# Altium project stimconnect.PrjPcb
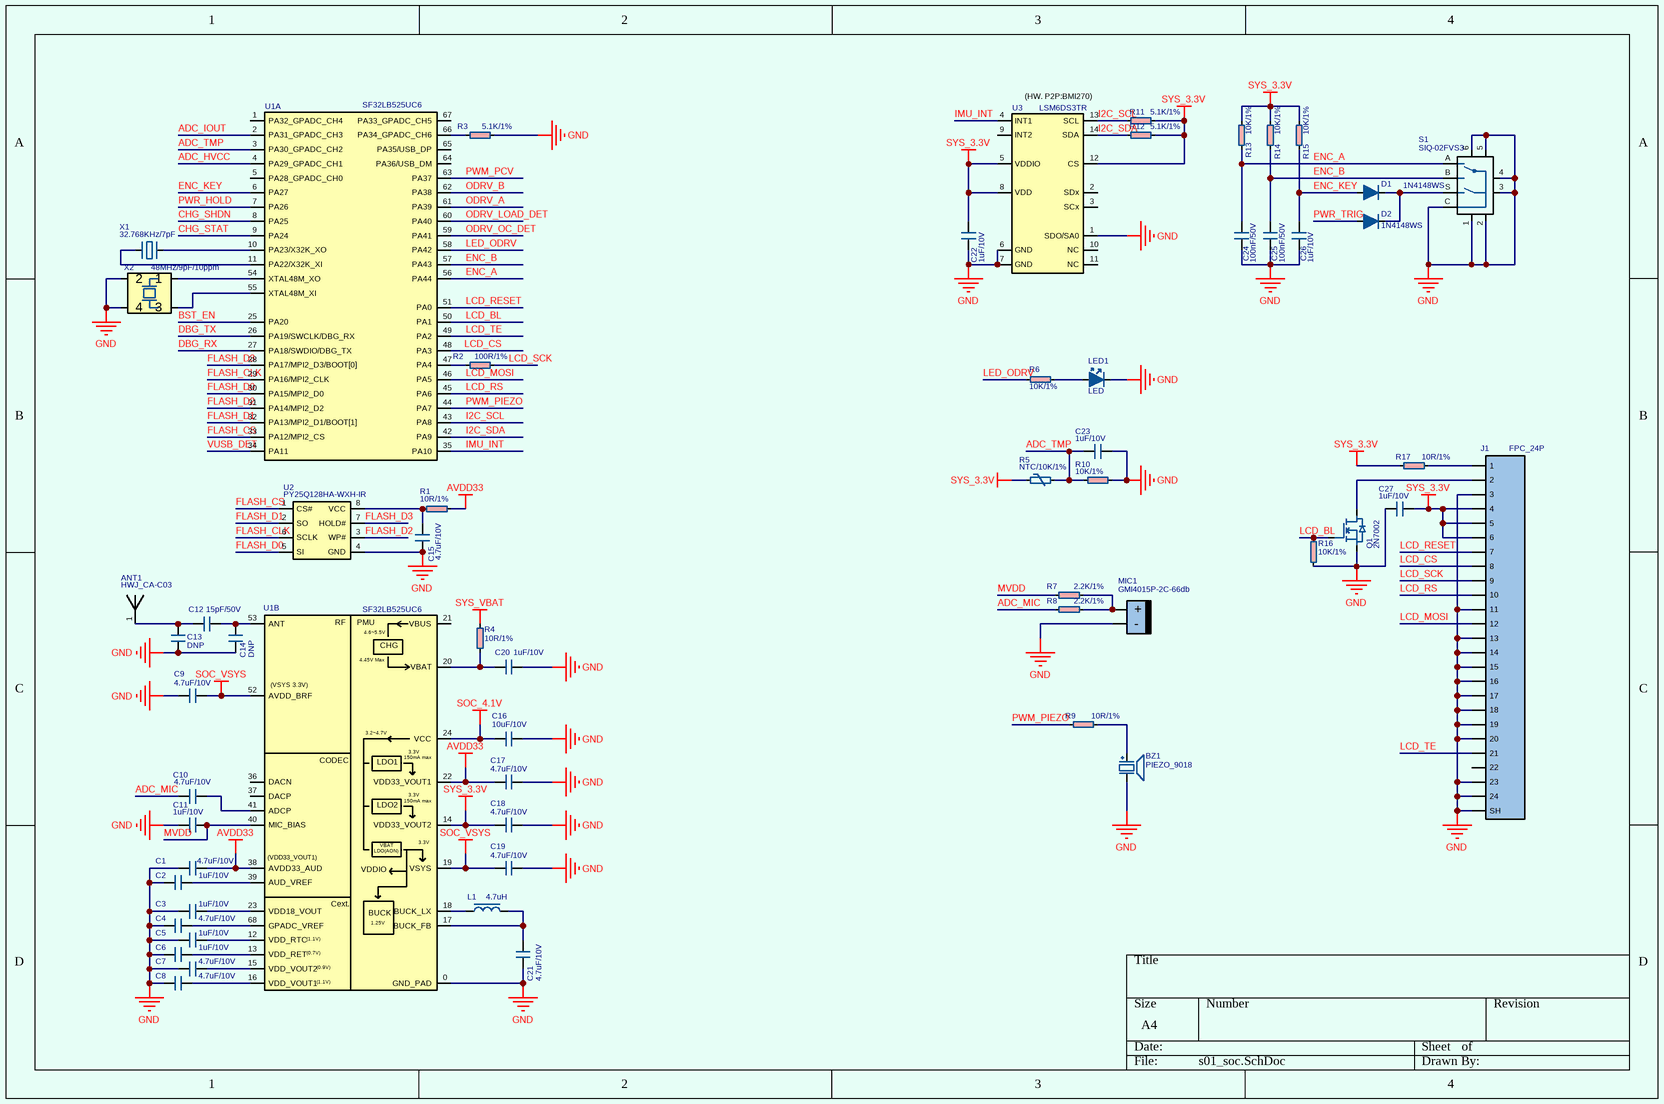
[diagram p0: s01_soc.SchDoc]
2 sheets, 184 parts. Net scope: global (net labels, ports and power ports of the same name join across sheets).
Board file: board.PcbDoc
Sheets:
  s01_soc.SchDoc
  s02_power.SchDoc

## Sheet s01_soc.SchDoc
size A4

### Parts
ANT1  HWJ_CA-C03  [ANT_2.4G_HWJ_CA-C03_MIRROR_OUTLINE]
BZ1  PIEZO_9018  [BUZZER_PIEZO_SMD_9X9X1.8MM_2PIN]
C1  4.7uF/10V  [0402C]
C2  1uF/10V  [0402C]
C3  1uF/10V  [0402C]
C4  4.7uF/10V  [0402C]
C5  1uF/10V  [0402C]
C6  1uF/10V  [0402C]
C7  4.7uF/10V  [0402C]
C8  4.7uF/10V  [0402C]
C9  4.7uF/10V  [0402C]
C10  4.7uF/10V  [0402C]
C11  1uF/10V  [0402C]
C12  15pF/50V  [0402C]
C13  DNP  [0402C]
C14  DNP  [0402C]
C15  4.7uF/10V  [0402C]
C16  10uF/10V  [0603C]
C17  4.7uF/10V  [0402C]
C18  4.7uF/10V  [0402C]
C19  4.7uF/10V  [0402C]
C20  1uF/10V  [0402C]
C21  4.7uF/10V  [0402C]
C22  1uF/10V  [0402C]
C23  1uF/10V  [0402C]
C24  100nF/50V  [0402C]
C25  100nF/50V  [0402C]
C26  1uF/10V  [0402C]
C27  1uF/10V  [0402C]
D1  1N4148WS  [SOD323]
D2  1N4148WS  [SOD323]
J1  FPC_24P  [FPC_0.5MM_24P_H1.0_DNUP_MIRROR_FH34SRJ-24S-0.5SH]
L1  4.7uH  [INDUCTOR_0806_HD]
LED1  LED  [LED_0603]
MIC1  GMI4015P-2C-66db  [MIC_DIP_F4_H1.5]
Q1  2N7002  [SOT23_MOS]
R1  10R/1%  [0402R]
R2  100R/1%  [0402R]
R3  5.1K/1%  [0402R]
R4  10R/1%  [0402R]
R5  NTC/10K/1%  [0402R]
R6  10K/1%  [0402R]
R7  2.2K/1%  [0402R]
R8  2.2K/1%  [0402R]
R9  10R/1%  [0603R]
R10  10K/1%  [0402R]
R11  5.1K/1%  [0402R]
R12  5.1K/1%  [0402R]
R13  10K/1%  [0402R]
R14  10K/1%  [0402R]
R15  10K/1%  [0402R]
R16  10K/1%  [0402R]
R17  10R/1%  [0402R]
S1  SIQ-02FVS3  [ENCODER_SMD_SIQ_02FVS3]
U1  SF32LB525UC6  [QFN68_0.35_7X7_H0.9]  (parts A,B of 2)
U2  PY25Q128HA-WXH-IR  [DFN_5X6_1.27_EPAD_FLASH]
U3  LSM6DS3TR  [LGA14_0.5_2.5X3_H0.9]
X1  32.768KHz/7pF  [XTAL_3215_2P]
X2  48MHz/9pF/10ppm  [XTAL_2016_4P_N]

### Nets
AVDD33: C1.2 C17.1 R1.1 U1.22(VDD33_VOUT1) U1.38(AVDD33_AUD)
GND: BZ1.2 C1.1 C2.1 C3.1 C4.1 C5.1 C6.1 C7.1 C8.1 C9.1 C11.1 C13.2 C14.1 C15.1 C16.1 C17.2 C18.2 C19.2 C20.1 C21.1 C22.1 C23.1 C24.1 C25.1 C26.1 C27.1 J1.0(SH) J1.3 J1.11 J1.13 J1.14 J1.15 J1.16 J1.17 J1.18 J1.19 J1.20 J1.23 J1.24 LED1.2 MIC1.2(-) Q1.S R3.2 R10.1 R16.2 S1.1 S1.2 S1.3 S1.4 S1.5 S1.6 S1.C U1.0(GND_PAD) U2.4(GND) U3.1(SDO/SA0) U3.6(GND) U3.7(GND) X2.2 X2.4
SOC_4.1V: C16.2 U1.24(VCC)
SOC_VSYS: C9.2 C19.1 U1.19(VSYS) U1.52(AVDD_BRF)
SYS_3.3V: C18.1 C22.2 C27.2 J1.4 J1.5 J1.6 R5.1 R11.1 R12.1 R13.2 R14.2 R15.2 R17.1 U1.14(VDD33_VOUT2) U3.5(VDDIO) U3.8(VDD) U3.12(CS)
SYS_VBAT: R4.1
ADC_HVCC: U1.4(PA29_GPADC_CH1)
ADC_IOUT: U1.2(PA31_GPADC_CH3)
ADC_MIC: C10.1 R8.2
ADC_TMP: C23.2 R5.2 R10.2 U1.3(PA30_GPADC_CH2)
BST_EN: U1.25(PA20)
CHG_SHDN: U1.8(PA25)
CHG_STAT: U1.9(PA24)
DBG_RX: U1.27(PA18/SWDIO/DBG_TX)
DBG_TX: U1.26(PA19/SWCLK/DBG_RX)
ENC_A: C24.2 R13.1 S1.A U1.56(PA44)
ENC_B: C25.2 R14.1 S1.B U1.57(PA43)
ENC_KEY: C26.2 D1.1 R15.1 U1.6(PA27)
FLASH_CLK: U1.29(PA16/MPI2_CLK) U2.6(SCLK)
FLASH_CS: U1.33(PA12/MPI2_CS) U2.1(CS#)
FLASH_D0: U1.30(PA15/MPI2_D0) U2.5(SI)
FLASH_D1: U1.32(PA13/MPI2_D1/BOOT[1]) U2.2(SO)
FLASH_D2: U1.31(PA14/MPI2_D2) U2.3(WP#)
FLASH_D3: U1.28(PA17/MPI2_D3/BOOT[0]) U2.7(HOLD#)
I2C_SCL: R11.2 U1.43(PA8) U3.13(SCL)
I2C_SDA: R12.2 U1.42(PA9) U3.14(SDA)
IMU_INT: U1.35(PA10) U3.4(INT1)
LCD_BL: Q1.G R16.1 U1.50(PA1)
LCD_CS: J1.8 U1.48(PA3)
LCD_MOSI: J1.12 U1.46(PA5)
LCD_RESET: J1.7 U1.51(PA0)
LCD_RS: J1.10 U1.45(PA6)
LCD_SCK: J1.9 R2.2
LCD_TE: J1.21 U1.49(PA2)
LED_ODRV: R6.2 U1.58(PA42)
MVDD: C11.2 R7.2 U1.40(MIC_BIAS)
ODRV_A: U1.61(PA39)
ODRV_B: U1.62(PA38)
ODRV_LOAD_DET: U1.60(PA40)
ODRV_OC_DET: U1.59(PA41)
PWM_PCV: U1.63(PA37)
PWM_PIEZO: R9.1 U1.44(PA7)
PWR_HOLD: U1.7(PA26)
PWR_TRIG: D2.1
VUSB_DET: U1.34(PA11)
NetANT1_1: ANT1.1(ANT) C12.2 C13.1
NetBZ1_1: BZ1.1 R9.2
NetC2_2: C2.2 U1.39(AUD_VREF)
NetC3_2: C3.2 U1.23(VDD18_VOUT)
NetC4_2: C4.2 U1.68(GPADC_VREF)
NetC5_2: C5.2 U1.12(VDD_RTC)
NetC6_2: C6.2 U1.13(VDD_RET)
NetC7_2: C7.2 U1.15(VDD_VOUT2)
NetC8_2: C8.2 U1.16(VDD_VOUT1)
NetC10_2: C10.2 U1.41(ADCP)
NetC12_1: C12.1 C14.2 U1.53(ANT)
NetC15_2: C15.2 R1.2 U2.8(VCC)
NetC20_2: C20.2 R4.2 U1.20(VBAT)
NetC21_2: C21.2 L1.2 U1.17(BUCK_FB)
NetD1_2: D1.2 D2.2 S1.S
NetJ1_1: J1.1 R17.2
NetJ1_2: J1.2 Q1.D
NetL1_1: L1.1 U1.18(BUCK_LX)
NetLED1_1: LED1.1 R6.1
NetMIC1_1: MIC1.1(+) R7.1 R8.1
NetR2_1: R2.1 U1.47(PA4)
NetR3_1: R3.1 U1.66(PA34_GPADC_CH6)
NetU1_10: U1.10(PA23/X32K_XO) X1.2
NetU1_11: U1.11(PA22/X32K_XI) X1.1
NetU1_54: U1.54(XTAL48M_XO) X2.1
NetU1_55: U1.55(XTAL48M_XI) X2.3

Not connected (* = marked no-connect by the designer): J1 22; U1 1(PA32_GPADC_CH4) 5(PA28_GPADC_CH0) 21(VBUS) 36(DACN) 37(DACP) 64(PA36/USB_DM) 65(PA35/USB_DP) 67(PA33_GPADC_CH5); U3 2(SDx) 3(SCx) 9(INT2) 10(NC) 11(NC)

### Notes on the sheet
- (near U3) (HW. P2P:BMI270)
- (in symbol SOC_SIFLI_SF32LB525UC6, part B) RF; PMU; 4.6~5.5V; CHG; 4.45V Max; (VSYS 3.3V); 3.2~4.7V; 3.3V; 150mA max; CODEC; LDO1; LDO2; LDO(AON); (VDD33_VOUT1); VDDIO; Cext.; BUCK; 1.25V; (1.1V); (0.7V); (0.9V)

### Library data of the parts
ANT1 = ANT_2.4G_HWJ_CA-C03: T-net: 0R-3nH-0R
BZ1 = BUZZER_PIEZO_2PIN
C1-C27 = CAP
D1 D2 = VD
J1 = CON24_FPC
L1 = INDUCTOR
LED1 = LED_GENERAL
MIC1 = MIC_ELE
Q1 = MOS_N
R1-R4 R6-R17 = RES
R5 = NTC
S1 = ENCODER_SIQ-02FVS3: Rotary encoder in 15 detents with push function
U1 = SOC_SIFLI_SF32LB525UC6: Li-ion power, 8MB psram, VSYS connect to VBAT
U2 = GD25Q32
U3 = LSM6DS3: always-on 3D accelerometer and 3D gyroscope
X1 = XTAL: Q13FC13500002
X2 = XTAL_SMT_PASSIVE4PIN: SX20Y048000B91T004

## Sheet s02_power.SchDoc
size A4
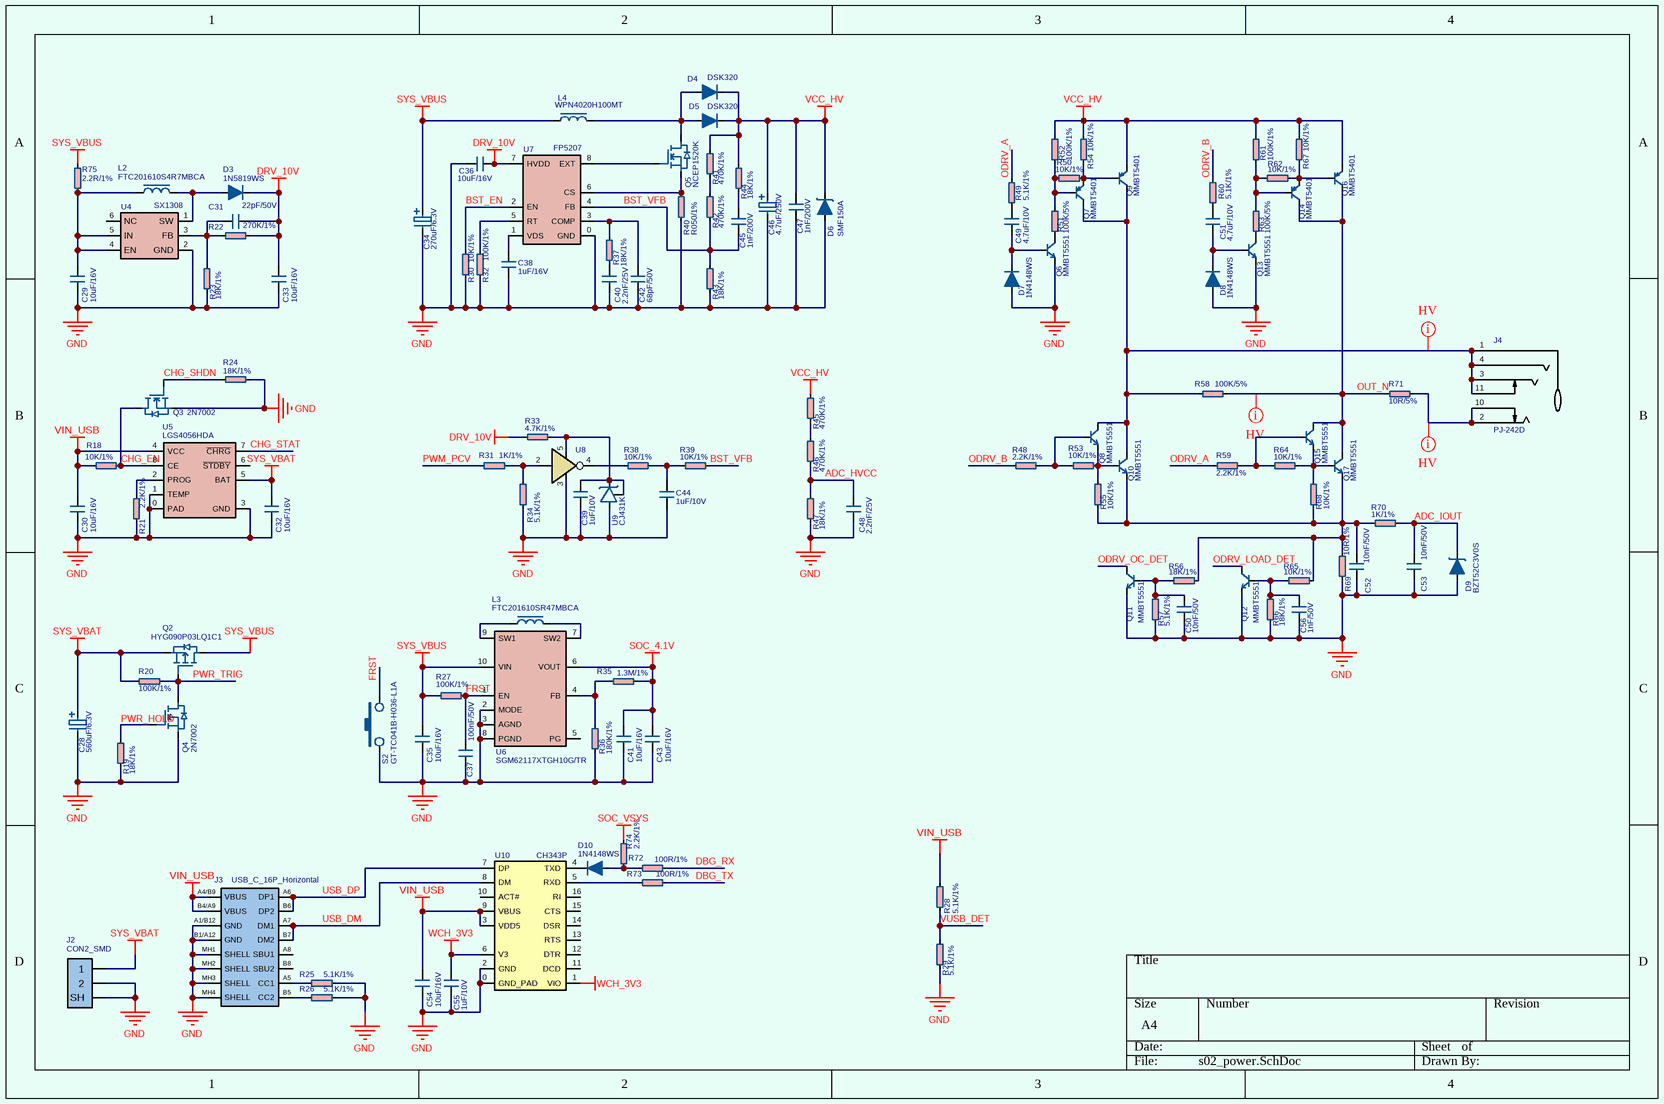
[diagram p1: s02_power.SchDoc]

### Parts
C28  560uF/6.3V  [CAP_EL_DIP_6.3X11_HOR_REV]
C29  10uF/16V  [0603C]
C30  10uF/16V  [0603C]
C31  22pF/50V  [0402C]
C32  10uF/16V  [0603C]
C33  10uF/16V  [0603C]
C34  270uF/6.3V  [CAP_EL_DIP_6.3X11_HOR_REV]
C35  10uF/16V  [0603C]
C36  10uF/16V  [0603C]
C37  100nF/50V  [0402C]
C38  1uF/16V  [0402C]
C39  1uF/10V  [0402C]
C40  2.2nF/25V  [0402C]
C41  10uF/16V  [0603C]
C42  68pF/50V  [0402C]
C43  10uF/16V  [0603C]
C44  1uF/10V  [0402C]
C45  1nF/200V  [0805C_N_HD]
C46  4.7uF/250V  [CAP_EL_DIP_6.3X11_HOR_REV]
C47  1nF/200V  [0805C_N_HD]
C48  2.2nF/25V  [0402C]
C49  4.7uF/10V  [0402C]
C50  10nF/50V  [0402C]
C51  4.7uF/10V  [0402C]
C52  10nF/50V  [0402C]
C53  10nF/50V  [0402C]
C54  10uF/16V  [0603C]
C55  1uF/10V  [0402C]
C56  1nF/50V  [0402C]
D3  1N5819WS  [SOD323_N]
D4  DSK320  [SOD123_N_HD]
D5  DSK320  [SOD123_N_HD]
D6  SMF150A  [SOD123_N_HD]
D7  1N4148WS  [SOD323]
D8  1N4148WS  [SOD323]
D9  BZT52C3V0S  [SOD323_N]
D10  1N4148WS  [SOD323]
J2  CON2_SMD  [PRT_1.25MM_2PIN_HOR_SMD]
J3  USB_C_16P_Horizontal  [USB_C_16P_FEMALE_HOR_L7.3_HD]
J4  PJ-242D  [CON_AUDIO_PJ_242]
L2  FTC201610S4R7MBCA  [INDUCTOR_0806_HD]
L3  FTC201610SR47MBCA  [INDUCTOR_0806_HD]
L4  WPN4020H100MT  [INDUCTOR_SWPA4020S]
Q2  HYG090P03LQ1C1  [DFN8_MOS_3X3]
Q3  2N7002  [SOT23_MOS]
Q4  2N7002  [SOT23_MOS]
Q5  NCEP1520K  [TO252_MOS]
Q6  MMBT5551  [SOT23_BCE]
Q7  MMBT5401  [SOT23_BCE]
Q8  MMBT5551  [SOT23_BCE]
Q9  MMBT5401  [SOT23_BCE]
Q10  MMBT5551  [SOT23_BCE]
Q11  MMBT5551  [SOT23_BCE]
Q12  MMBT5551  [SOT23_BCE]
Q13  MMBT5551  [SOT23_BCE]
Q14  MMBT5401  [SOT23_BCE]
Q15  MMBT5551  [SOT23_BCE]
Q16  MMBT5401  [SOT23_BCE]
Q17  MMBT5551  [SOT23_BCE]
R18  10K/1%  [0402R]
R19  18K/1%  [0402R]
R20  100K/1%  [0402R]
R21  2.2K/1%  [0402R]
R22  270K/1%  [0402R]
R23  18K/1%  [0402R]
R24  18K/1%  [0402R]
R25  5.1K/1%  [0402R]
R26  5.1K/1%  [0402R]
R27  100K/1%  [0402R]
R28  5.1K/1%  [0402R]
R29  5.1K/1%  [0402R]
R30  10K/1%  [0402R]
R31  1K/1%  [0402R]
R32  100K/1%  [0402R]
R33  4.7K/1%  [0402R]
R34  5.1K/1%  [0402R]
R35  1.3M/1%  [0402R]
R36  180K/1%  [0402R]
R37  18K/1%  [0402R]
R38  10K/1%  [0402R]
R39  10K/1%  [0402R]
R40  R050/1%  [1206R_N_HD]
R41  470K/1%  [0805R_N_HD]
R42  470K/1%  [0805R_N_HD]
R43  18K/1%  [0402R]
R44  18K/1%  [0402R]
R45  470K/1%  [0805R_N_HD]
R46  470K/1%  [0805R_N_HD]
R47  18K/1%  [0402R]
R48  2.2K/1%  [0402R]
R49  5.1K/1%  [0402R]
R50  10K/1%  [0402R]
R51  100K/5%  [0805R]
R52  100K/1%  [0402R]
R53  10K/1%  [0402R]
R54  10K/1%  [0402R]
R55  10K/1%  [0402R]
R56  18K/1%  [0402R]
R57  5.1K/1%  [0402R]
R58  100K/5%  [0805R]
R59  2.2K/1%  [0402R]
R60  5.1K/1%  [0402R]
R61  100K/1%  [0402R]
R62  10K/1%  [0402R]
R63  100K/5%  [0805R]
R64  10K/1%  [0402R]
R65  10K/1%  [0402R]
R66  18K/1%  [0402R]
R67  10K/1%  [0402R]
R68  10K/1%  [0402R]
R69  10R/1%  [0805R_N_HD]
R70  1K/1%  [0402R]
R71  10R/5%  [0805R]
R72  100R/1%  [0402R]
R73  100R/1%  [0402R]
R74  2.2K/1%  [0402R]
R75  2.2R/1%  [0402R]
S2  GT-TC041B-H036-L1A  [SW_MEDIUM_TURTLE]
U4  SX1308  [SOT23_6]
U5  LGS4056HDA  [DFN8_0.5_2X2]
U6  SGM62117XTGH10G/TR  [DFN8_0.5_3X2_SGM62117]
U7  FP5207  [SOP8_150MIL_PAD_N_HD]
U8  SN74LVC1G14DBVR  [SOT23_5]  (value not drawn)
U9  CJ431K  [SOT23]
U10  CH343P  [QFN16_0.5_3X3]

### Nets
DRV_10V: C31.1 C33.1 C36.1 D3.2 R22.1 R33.1 U7.7(HVDD)
GND: C28.2 C29.2 C30.2 C32.2 C33.2 C34.2 C35.2 C36.2 C37.1 C38.1 C39.1 C40.1 C41.2 C42.1 C43.2 C44.1 C46.2 C47.1 C48.1 C50.1 C52.1 C53.1 C54.2 C55.1 C56.1 D6.1 D7.1 D8.1 D9.1 J2.0(SH) J2.2 J3.A1/B12(GND) J3.B1/A12(GND) J3.MH1(SHELL) J3.MH2(SHELL) J3.MH3(SHELL) J3.MH4(SHELL) Q3.S Q4.S Q6.E Q11.E Q12.E Q13.E R19.1 R21.2 R23.1 R24.1 R25.1 R26.1 R29.1 R30.1 R32.1 R34.2 R36.2 R40.1 R43.1 R47.1 R57.2 R66.2 R69.2 S2.2 U4.2(GND) U5.0(PAD) U5.1(TEMP) U5.3(GND) U6.2(MODE) U6.3(AGND) U6.8(PGND) U7.0(GND) U8.3(G) U9.3 U10.0(GND_PAD) U10.2(GND)
SOC_4.1V: C41.1 C43.1 R35.2 U6.6(VOUT)
SOC_VSYS: R74.1
SYS_VBAT: C28.1 C32.1 J2.1 Q2.S R20.2 U5.5(BAT)
SYS_VBUS: C34.1 C35.1 L4.1 Q2.D R27.2 R75.1 U6.10(VIN)
VCC_HV: C46.1 C47.2 D4.2 D5.2 D6.2 Q9.E Q16.E R41.2 R44.2 R45.2 R52.1 R54.1 R61.1 R67.1
VIN_USB: C30.1 C54.1 J3.A4/B9(VBUS) J3.B4/A9(VBUS) R18.2 R28.2 U5.4(VCC) U10.3(VDD5) U10.9(VBUS)
WCH_3V3: C55.2 U10.1(VIO) U10.6(V3)
ADC_HVCC: C48.2 R46.1 R47.2
ADC_IOUT: C53.2 D9.2 R70.1
BST_EN: R30.2 U7.2(EN)
BST_VFB: C45.1 R39.1 R42.1 R43.2 U7.4(FB)
CHG_EN: Q3.D R18.1 U5.8(CE)
CHG_SHDN: Q3.G R24.2
CHG_STAT: U5.7(~{CHRG})
DBG_RX: R72.1
DBG_TX: R73.1
FRST: C37.2 R27.1 S2.1 U6.1(EN)
ODRV_A: R49.2 R59.2
ODRV_B: R48.2 R60.2
ODRV_LOAD_DET: Q12.C
ODRV_OC_DET: Q11.C
OUT_N: Q14.C Q15.C Q16.C Q17.C R58.2 R71.2
PWM_PCV: R31.2
PWR_HOLD: Q4.G R19.2
PWR_TRIG: Q2.G Q4.D R20.1
USB_DM: J3.A7(DM1) J3.B7(DM2) U10.8(DM)
USB_DP: J3.A6(DP1) J3.B6(DP2) U10.7(DP)
VUSB_DET: R28.1 R29.2
NetC29_1: C29.1 L2.1 R75.2 U4.4(EN) U4.5(IN)
NetC31_2: C31.2 R22.2 R23.2 U4.3(FB)
NetC38_2: C38.2 U7.1(VDS)
NetC39_2: C39.2 R33.2 U8.5(VCC) U9.1 U9.2
NetC40_2: C40.2 R37.1
NetC42_2: C42.2 R37.2 U7.3(COMP)
NetC44_2: C44.2 R38.1 R39.2
NetC45_2: C45.2 R44.1
NetC49_1: C49.1 R49.1
NetC49_2: C49.2 D7.2 Q6.B
NetC50_2: C50.2 Q11.B R56.2 R57.1
NetC51_1: C51.1 D8.2 Q13.B
NetC51_2: C51.2 R60.1
NetC52_2: C52.2 Q10.E Q17.E R55.1 R56.1 R65.1 R68.1 R69.1 R70.2
NetC56_2: C56.2 Q12.B R65.2 R66.1
NetD3_1: D3.1 L2.2 U4.1(SW)
NetD4_1: D4.1 D5.1 L4.2 Q5.D
NetD10_1: D10.1 R72.2 R74.2
NetD10_2: D10.2 U10.4(TXD)
NetJ3_A5: J3.A5(CC1) R25.2
NetJ3_B5: J3.B5(CC2) R26.2
NetJ4_1: J4.1 J4.3 J4.4 J4.11 Q7.C Q8.C Q9.C Q10.C R58.1
NetJ4_2: J4.2 J4.10 R71.1
NetL3_1: L3.1 U6.9(SW1)
NetL3_2: L3.2 U6.7(SW2)
NetQ5_G: Q5.G U7.8(EXT)
NetQ5_S: Q5.S R40.2 U7.6(CS)
NetQ6_C: Q6.C R51.2
NetQ7_B: Q7.B R50.2 R51.1 R52.2
NetQ7_E: Q7.E Q9.B R50.1 R54.2
NetQ8_B: Q8.B R48.1 R53.1
NetQ8_E: Q8.E Q10.B R53.2 R55.2
NetQ13_C: Q13.C R63.2
NetQ14_B: Q14.B R61.2 R62.2 R63.1
NetQ14_E: Q14.E Q16.B R62.1 R67.2
NetQ15_B: Q15.B R59.1 R64.1
NetQ15_E: Q15.E Q17.B R64.2 R68.2
NetR21_1: R21.1 U5.2(PROG)
NetR31_1: R31.1 R34.1 U8.2(A)
NetR32_2: R32.2 U7.5(RT)
NetR35_1: R35.1 R36.1 U6.4(FB)
NetR38_2: R38.2 U8.4(Y)
NetR41_1: R41.1 R42.2
NetR45_1: R45.1 R46.2
NetR73_2: R73.2 U10.5(RXD)

Not connected (* = marked no-connect by the designer): J3 A8(SBU1) B8(SBU2); U4 6(NC); U5 6(~{STDBY}); U6 5(PG); U10 10(ACT#) 11(DCD) 12(DTR) 13(RTS) 14(DSR) 15(CTS) 16(RI)

### Layout directives
net class HV: NetJ4_1, NetJ4_2, OUT_N

### Library data of the parts
C28 C34 C46 = CAP_EL
C29-C33 C35-C44 C48-C56 = CAP
C45 C47 = CAP: CC0805JRNPOABN102
D3-D5 D7 D8 D10 = VD
D6 D9 = VS
J3 = USB_TYPEC_16P_Horizontal_4MP
J4 = CON_AUDIO_PJ_242D
L2-L4 = INDUCTOR
Q2 = MOS_P
Q3-Q5 = MOS_N
Q6 Q8 Q10-Q13 Q15 Q17 = BJT_NPN
Q7 Q9 Q14 Q16 = BJT_PNP
R18-R75 = RES
S2 = SW_PB
U5 = TP4056
U6 = SGM62117: Buck-Boost Converter, 18uA, 2.2 to 5.5V IN, 1.8 to 5.2V OUT
U8 = SN74AHC1G14: 1-Channel Schmitt-Trigger Inverter Gate
U9 = TL431
U10 = CH343P: USB to UART converter

## Nets that join several sheets
GND: s01_soc (59 pins), s02_power (73 pins)
SOC_4.1V: s01_soc (C16.2 U1.24), s02_power (C41.1 C43.1 R35.2 U6.6)
SOC_VSYS: s01_soc (C9.2 C19.1 U1.19 U1.52), s02_power (R74.1)
SYS_VBAT: s01_soc (R4.1), s02_power (6 pins)
ADC_HVCC: s01_soc (U1.4), s02_power (C48.2 R46.1 R47.2)
ADC_IOUT: s01_soc (U1.2), s02_power (C53.2 D9.2 R70.1)
BST_EN: s01_soc (U1.25), s02_power (R30.2 U7.2)
CHG_SHDN: s01_soc (U1.8), s02_power (Q3.G R24.2)
CHG_STAT: s01_soc (U1.9), s02_power (U5.7)
DBG_RX: s01_soc (U1.27), s02_power (R72.1)
DBG_TX: s01_soc (U1.26), s02_power (R73.1)
ODRV_A: s01_soc (U1.61), s02_power (R49.2 R59.2)
ODRV_B: s01_soc (U1.62), s02_power (R48.2 R60.2)
ODRV_LOAD_DET: s01_soc (U1.60), s02_power (Q12.C)
ODRV_OC_DET: s01_soc (U1.59), s02_power (Q11.C)
PWM_PCV: s01_soc (U1.63), s02_power (R31.2)
PWR_HOLD: s01_soc (U1.7), s02_power (Q4.G R19.2)
PWR_TRIG: s01_soc (D2.1), s02_power (Q2.G Q4.D R20.1)
VUSB_DET: s01_soc (U1.34), s02_power (R28.1 R29.2)